# EAGLE design boost-demux_v1 (EAGLE 8.3.1)
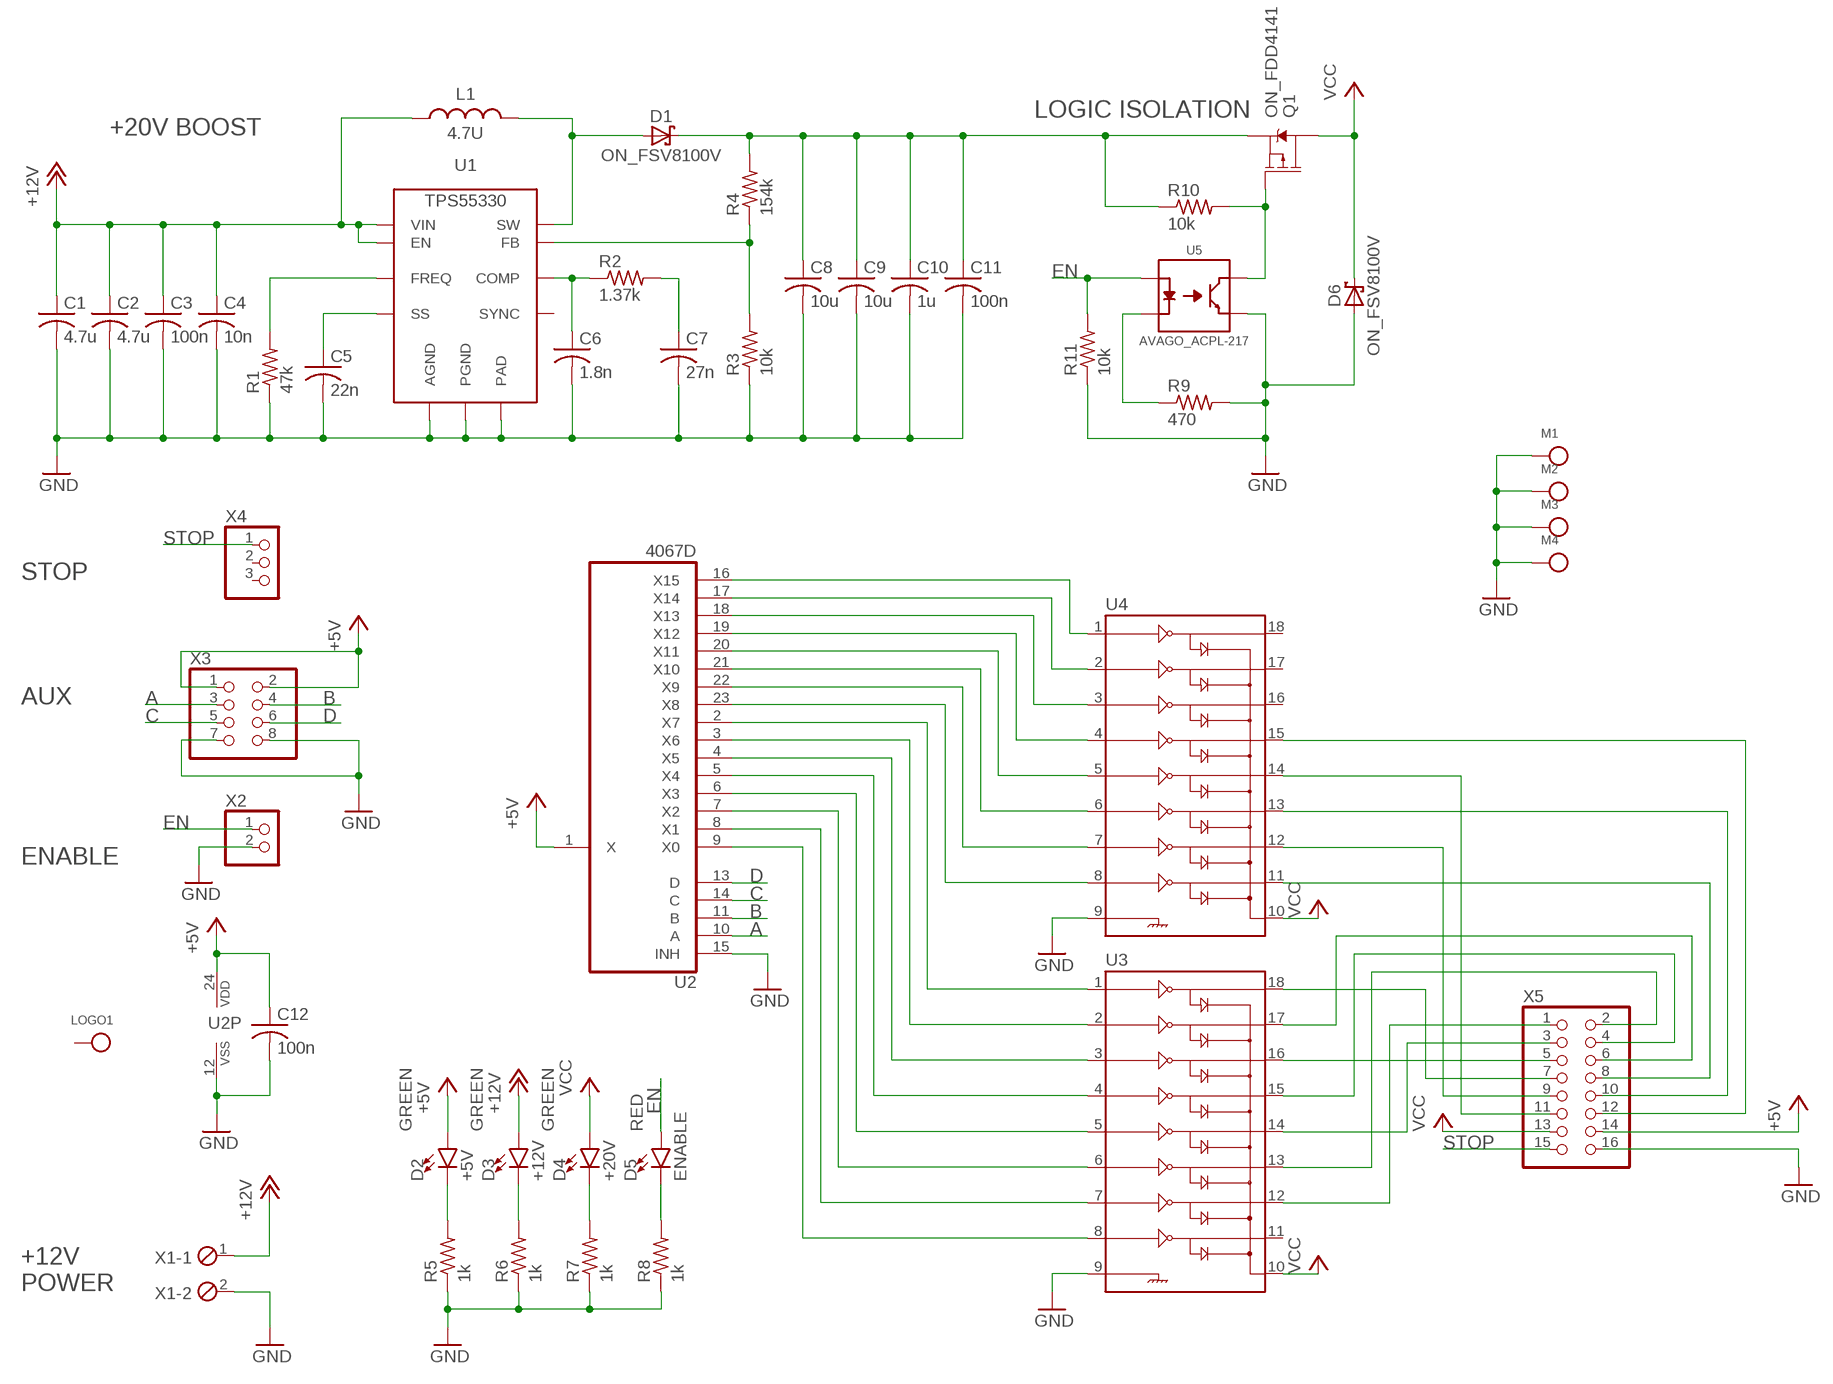
[diagram p0: schematic, sheet 1]

## Parts
C1  4.7u  C-USC1206  [C1206]
C2  4.7u  C-USC1206  [C1206]
C3  100n  C-USC1206  [C1206]
C4  10n  C-USC1206  [C1206]
C5  22n  C-USC1206  [C1206]
C6  1.8n  C-USC0805  [C0805]
C7  27n  C-USC0805  [C0805]
C8  10u  C-USC1206  [C1206]
C9  10u  C-USC1206  [C1206]
C10  1u  C-USC1206  [C1206]
C11  100n  C-USC1206  [C1206]
C12  100n  C-USC1206  [C1206]
D1  ON_FSV8100V  [TO-277-3]
D2  +5V  LED5MM  [LED_5MM]
D3  +12V  LED5MM  [LED_5MM]
D4  +20V  LED5MM  [LED_5MM]
D5  ENABLE  LED5MM  [LED_5MM]
D6  ON_FSV8100V  [TO-277-3]
L1  4.7U  MURATA_FDVE1040  [4440]
LOGO1  MADOG  [MADOG]
M1  6-32_MOUNT  [6-32_MOUNT]
M2  6-32_MOUNT  [6-32_MOUNT]
M3  6-32_MOUNT  [6-32_MOUNT]
M4  6-32_MOUNT  [6-32_MOUNT]
Q1  ON_FDD4141  [TO-252-3]
R1  47k  R-US_R1206  [R1206]
R2  1.37k  R-US_R0805  [R0805]
R3  10k  R-US_R0805  [R0805]
R4  154k  R-US_R0805  [R0805]
R5  1k  R-US_R1206  [R1206]
R6  1k  R-US_R1206  [R1206]
R7  1k  R-US_R1206  [R1206]
R8  1k  R-US_R1206  [R1206]
R9  470  R-US_R1206  [R1206]
R10  10k  R-US_R0805  [R0805]
R11  10k  R-US_R0805  [R0805]
U1  TI_TPS55330  [S-PWQFN-N16]
U2  4067D  [SO24W]
U3  ULN2803SOICW  [SO18L]
U4  ULN2803SOICW  [SO18L]
U5  AVAGO_ACPL-217  [SOIC-4]
X1  MPT2  [2POL254]
X2  PINHD-1X2/90  [1X02/90]
X3  PINHD-2X4/90  [2X04/90]
X4  PINHD-1X3/90  [1X03/90]
X5  PINHD-2X8  [2X08]

## Nets
+5V: C12.1 D2.A U2.1(X) U2.24(VDD) X3.1 X3.2 X5.14
+12V: C1.1 C2.1 C3.1 C4.1 D3.A L1.1 U1.2(VIN) U1.3(EN) X1.1
A: U2.10(A) X3.3
B: U2.11(B) X3.4
C: U2.14(C) X3.5
D: U2.13(D) X3.6
EN: D5.A R11.2 U5.P$1 X2.1
GND: C1.2 C2.2 C3.2 C4.2 C5.2 C6.2 C7.2 C8.2 C9.2 C10.2 C11.2 C12.2 D6.P$1(A) D6.P$2(A) M1.P$1 M1.P$2 M1.P$3 M1.P$4 M1.P$5 M1.P$6 M1.P$7 M1.P$8 M1.P$9 M2.P$1 M2.P$2 M2.P$3 M2.P$4 M2.P$5 M2.P$6 M2.P$7 M2.P$8 M2.P$9 M3.P$1 M3.P$2 M3.P$3 M3.P$4 M3.P$5 M3.P$6 M3.P$7 M3.P$8 M3.P$9 M4.P$1 M4.P$2 M4.P$3 M4.P$4 M4.P$5 M4.P$6 M4.P$7 M4.P$8 M4.P$9 R1.1 R3.1 R5.1 R6.1 R7.1 R8.1 R9.2 R11.1 U1.6(AGND) U1.11(PGND) U1.12(PGND) U1.13(PGND) U1.PAD U2.12(VSS) U2.15(INH) U3.9 U4.9 U5.P$3 X1.2 X2.2 X3.7 X3.8 X5.16
N$1: R1.2 U1.9(FREQ)
N$2: C5.1 U1.4(SS)
N$3: C6.1 R2.1 U1.7(COMP)
N$4: C7.1 R2.2
N$5: R3.2 R4.1 U1.8(FB)
N$6: D2.K(C) R5.2
N$7: D1.P$1(A) D1.P$2(A) L1.2 U1.1(SW) U1.15(SW) U1.16(SW)
N$8: D3.K(C) R6.2
N$9: D4.K(C) R7.2
N$10: D5.K(C) R8.2
N$11: U2.9(X0) U3.8
N$12: C8.1 C9.1 C10.1 C11.1 D1.P$3(C) Q1.P$3(S) R4.2 R10.1
N$13: Q1.P$1(G) R10.2 U5.P$4
N$14: U3.12 X5.1
N$15: U2.8(X1) U3.7
N$16: U2.7(X2) U3.6
N$17: U2.6(X3) U3.5
N$18: U3.13 X5.2
N$19: R9.1 U5.P$2
N$20: U2.5(X4) U3.4
N$21: U2.4(X5) U3.3
N$22: U2.3(X6) U3.2
N$23: U2.2(X7) U3.1
N$24: U2.23(X8) U4.8
N$25: U2.22(X9) U4.7
N$26: U2.21(X10) U4.6
N$27: U2.20(X11) U4.5
N$28: U2.19(X12) U4.4
N$29: U2.18(X13) U4.3
N$30: U2.17(X14) U4.2
N$31: U2.16(X15) U4.1
N$32: U3.14 X5.3
N$33: U3.15 X5.4
N$34: U3.16 X5.5
N$35: U3.17 X5.6
N$36: U3.18 X5.7
N$37: U4.11 X5.8
N$38: U4.12 X5.9
N$39: U4.13 X5.10
N$40: U4.14 X5.11
N$41: U4.15 X5.12
STOP: X4.1 X5.15
VCC: D4.A D6.P$3(C) Q1.P$4(D) U3.10 U4.10 X5.13
Unconnected: LOGO1.P$1 U1.5(SYNC) U3.11 U4.16 U4.17 U4.18 X4.2 X4.3

## Notes on the sheet
- LOGIC ISOLATION
- +20V BOOST
- STOP
- AUX
- ENABLE
- GREEN | GREEN | GREEN | RED
- +12V
  POWER

## Library data of the parts
C1-C12 = rcl:C-US: CAPACITOR, American symbol
D1 D6 = components:ON_FSV8100V
D2-D5 = SparkFun-LED:LED: LED (Generic) Standard schematic elements and footprints for 5mm, 3mm, 1206, and 0603 sized LEDs. Generic LEDs with no color specified.
L1 = components:MURATA_FDVE1040
LOGO1 = components:MADOG
M1-M4 = components:6-32_MOUNT
Q1 = components:ON_FDD4141
R1-R4 R10 R11 = rcl:R-US_: RESISTOR, American symbol
R5-R9 = resistor:R-US_: RESISTOR, American symbol
U1 = components:TI_TPS55330
U2 = 40xx:4067: 16-channel ANALOG MULTIPLEXER
U3 U4 = SparkFun-PowerIC:ULN2803: Darlington Driver ULN2803 Darlington array. 500mA max per channel, 8-channel package. Spark Fun Electronics SKU : COM-00312
U5 = components:AVAGO_ACPL-217
X1 = con-phoenix-254:MPT2: PHOENIX CONNECTOR; OC_FARNELL: unknown; OC_NEWARK: unknown
X2 = pinhead:PINHD-1X2: PIN HEADER
X3 = pinhead:PINHD-2X4: PIN HEADER
X4 = pinhead:PINHD-1X3: PIN HEADER
X5 = pinhead:PINHD-2X8: PIN HEADER

## Board
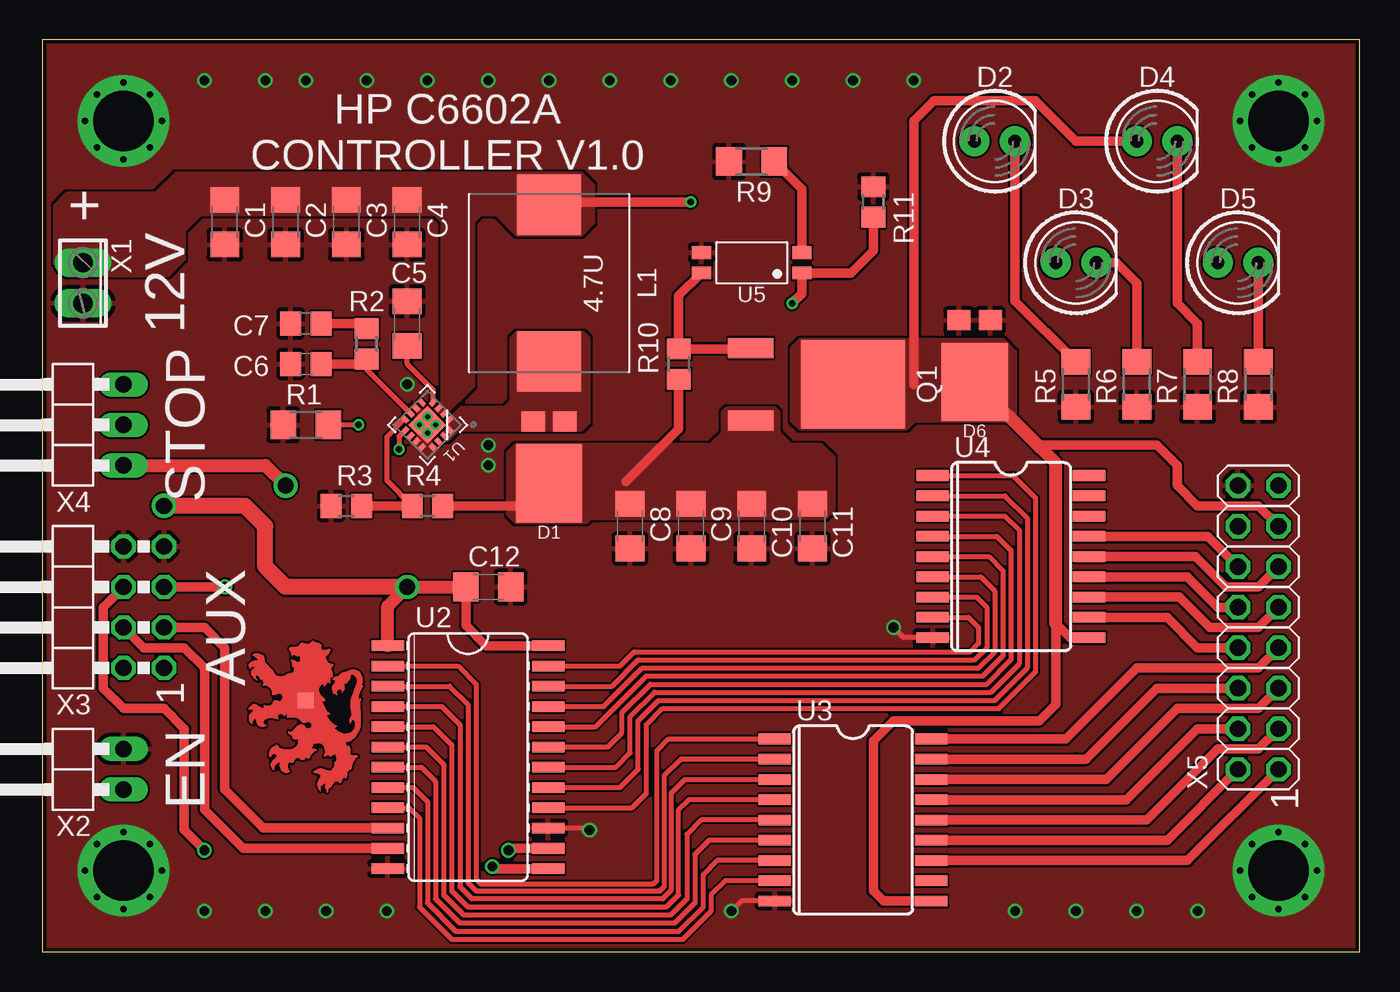
[diagram p1: board, top side]
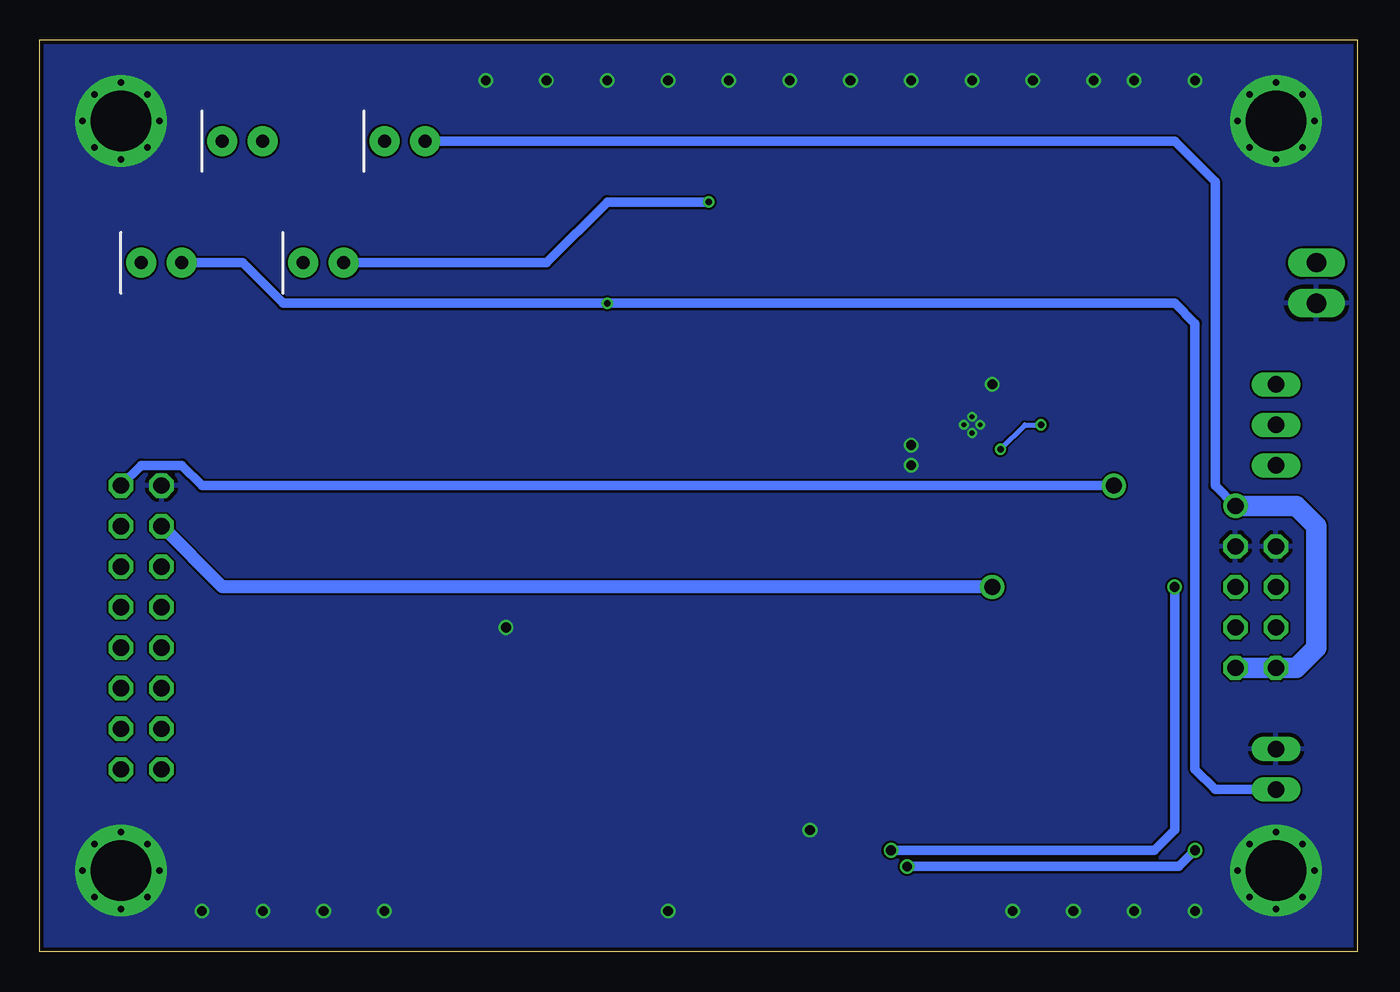
[diagram p2: board, bottom side, seen from below]

Size 82.55 x 57.15 mm. Coordinates in mm from the lower left corner, seen from the top.
Outline: 0,0 82.55,0 82.55,57.15 0,57.15 0,0
Copper layers (1*16): Top 0.035mm / dielectric 1.5mm / Bottom 0.035mm
Design rules "DirtyPCBs-2layer": minimum track width 5mil, minimum drill 12mil, track to track 5mil, track to pad 5mil, pad to pad 5mil, via to via 5mil, smd to smd 0mil, copper to edge 10mil, drill to drill 10mil, minimum pad ring 10mil, minimum via ring 6mil, stop-mask expansion 2mil, vias tented up to drill 25mil, thermal gap 10mil

### Footprints (pad centres in the part's own frame; a part is rotated, then mirrored left to right if it is on the bottom)
C1206 = smd 1.6 x 1.8: 1 -1.4,0; 2 1.4,0
C0805 = smd 1.3 x 1.5: 1 -0.95,0; 2 0.95,0
TO-277-3 = smd 1.45 x 1.25: P$1 0.985,-2.75; P$2 -0.985,-2.75 | smd 4.15 x 4.9: P$3 0,1.125
LED_5MM = drill 0.813 pad 1.88: A -1.27,0; K 1.27,0
4440 = smd 3.8 x 4: 1 -4.9,0; 2 4.9,0
MADOG = smd 1 x 1: P$1 0,1
6-32_MOUNT = drill 3.797 pad 5.715: P$1 0,0 | drill 0.406 pad 0.635: P$2 -2.413,0; P$3 0,2.413; P$4 2.413,0; P$5 0,-2.413; P$6 -1.651,-1.651; P$7 -1.651,1.651; P$8 1.651,1.651; P$9 1.651,-1.651
TO-252-3 = smd 1.25 x 2.85: P$1 -2.28,-6.4; P$3 2.28,-6.4 | smd 5.55 x 6.5: P$4 0,0
R1206 = smd 1.6 x 1.803: 1 -1.422,0; 2 1.422,0
R0805 = smd 1.3 x 1.5: 1 -0.95,0; 2 0.95,0
S-PWQFN-N16 = smd 0.5 x 0.3: 1 -1.25,0.75; 2 -1.25,0.25; 3 -1.25,-0.25; 4 -1.25,-0.75; 9 1.25,-0.75; 10 1.25,-0.25; 11 1.25,0.25; 12 1.25,0.75 | smd 0.3 x 0.5: 5 -0.75,-1.25; 6 -0.25,-1.25; 7 0.25,-1.25; 8 0.75,-1.25; 13 0.75,1.25; 14 0.25,1.25; 15 -0.25,1.25; 16 -0.75,1.25 | smd 1.65 x 1.65: PAD 0,0
SO24W = smd 0.66 x 2.032: 1 -6.985,-5.029; 2 -5.715,-5.029; 3 -4.445,-5.029; 4 -3.175,-5.029; 5 -1.905,-5.029; 6 -0.635,-5.029; 7 0.635,-5.029; 8 1.905,-5.029; 9 3.175,-5.029; 10 4.445,-5.029; 11 5.715,-5.029; 12 6.985,-5.029; 13 6.985,5.029; 14 5.715,5.029; 15 4.445,5.029; 16 3.175,5.029; 17 1.905,5.029; 18 0.635,5.029; 19 -0.635,5.029; 20 -1.905,5.029; 21 -3.175,5.029; 22 -4.445,5.029; 23 -5.715,5.029; 24 -6.985,5.029
SO18L = smd 0.66 x 2.032: 1 -0.635,-4.902; 2 0.635,-4.902; 3 1.905,-4.902; 4 3.175,-4.902; 5 4.445,-4.902; 6 5.715,-4.902; 7 6.985,-4.902; 8 8.255,-4.902; 9 9.525,-4.902; 10 9.525,4.902; 11 8.255,4.902; 12 6.985,4.902; 13 5.715,4.902; 14 4.445,4.902; 15 3.175,4.902; 16 1.905,4.902; 17 0.635,4.902; 18 -0.635,4.902
SOIC-4 = smd 1.2 x 0.8: P$1 -3.15,0.635; P$2 -3.15,-0.635; P$3 3.15,-0.635; P$4 3.15,0.635
2POL254 = drill 1.2 long: 1 -1.27,0; 2 1.27,0
1X02/90 = drill 1.016 long: 1 -1.27,-3.81; 2 1.27,-3.81
2X04/90 = drill 1.016 octagon: 1 -3.81,-6.35; 2 -3.81,-3.81; 3 -1.27,-6.35; 4 -1.27,-3.81; 5 1.27,-6.35; 6 1.27,-3.81; 7 3.81,-6.35; 8 3.81,-3.81
1X03/90 = drill 1.016 long: 1 -2.54,-3.81; 2 0,-3.81; 3 2.54,-3.81
2X08 = drill 1.016 octagon: 1 -8.89,-1.27; 2 -8.89,1.27; 3 -6.35,-1.27; 4 -6.35,1.27; 5 -3.81,-1.27; 6 -3.81,1.27; 7 -1.27,-1.27; 8 -1.27,1.27; 9 1.27,-1.27; 10 1.27,1.27; 11 3.81,-1.27; 12 3.81,1.27; 13 6.35,-1.27; 14 6.35,1.27; 15 8.89,-1.27; 16 8.89,1.27

### Placement (x,y rotation side)
C1  11.43,45.72 270 top
C2  15.24,45.72 270 top
C3  19.05,45.72 270 top
C4  22.86,45.72 270 top
C5  22.86,39.37 90 top
C6  16.51,36.83 180 top
C7  16.51,39.37 180 top
C8  36.83,26.67 270 top
C9  40.64,26.67 270 top
C10  44.45,26.67 270 top
C11  48.26,26.67 270 top
C12  27.94,22.86 0 top
D1  31.75,30.48 180 top
D2  59.69,50.8 0 top
D3  64.77,43.18 0 top
D4  69.85,50.8 0 top
D5  74.93,43.18 0 top
D6  58.42,36.83 180 top
L1  31.75,41.91 270 top
LOGO1  16.51,14.73 0 top
M1  5.08,52.07 0 top
M2  5.08,5.08 0 top
M3  77.47,52.07 0 top
M4  77.47,5.08 0 top
Q1  50.8,35.56 270 top
R1  16.51,33.02 0 top
R2  20.32,38.1 90 top
R3  19.05,27.94 0 top
R4  24.13,27.94 0 top
R5  64.77,35.56 90 top
R6  68.58,35.56 90 top
R7  72.39,35.56 90 top
R8  76.2,35.56 90 top
R9  44.45,49.53 180 top
R10  39.88,36.83 90 top
R11  52.07,46.99 270 top
U1  24.13,33.02 225 top
U2  26.67,12.19 270 top
U3  50.8,12.7 270 top
U4  60.71,29.21 270 top
U5  44.45,43.18 180 top
X1  2.54,41.91 270 top
X2  1.27,11.43 90 top
X3  1.27,21.59 90 top
X4  1.27,33.02 90 top
X5  76.2,20.32 90 top

### Tracks (layer width: path | path; a pad name or v marks a point on that pad's centre or on a via)
+5V  (via drill 1.02)
  Top 0.61: U2.24 27.81,19.18 26.54,20.45 C12.1
  Top 0.813: U2.1 21.64,21.64 v22.86,22.86 C12.1
  Top 1.016: v22.86,22.86 15.24,22.86 13.97,24.13 13.97,26.67 12.7,27.94 v7.62,27.94
  Bottom 0.61: D2.A 11.43,50.8 8.89,48.26 8.89,29.21 v7.62,27.94
  Bottom 0.813: v22.86,22.86 71.12,22.86 X5.14
  Bottom 1.27: v7.62,27.94 3.81,27.94 2.54,26.67 2.54,19.05 3.81,17.78 X3.2 X3.1
+12V  (via drill 0.41)
  Top 0.61: v40.64,46.99 31.93,46.99 L1.1
  Bottom 0.61: D3.A 50.8,43.18 46.99,46.99 v40.64,46.99
  pour Top (no thermals): 1.52,42.42 7.87,42.42 8.89,43.43 8.89,45.21 9.91,46.23 28.45,46.23 29.72,44.96 33.78,44.96 34.54,45.72 34.54,48.01 33.78,48.77 8.38,48.77 7.11,47.5 1.52,47.5 0.76,46.74 0.76,43.18
  pour Top (no thermals): 24.61,34.01 25.02,34.42 25.02,45.72 24.51,46.23 27.56,46.23 27.05,45.72 27.05,35.43 25.12,33.5
A
  Top 0.61: U2.10 13.84,7.75 11.43,10.16 11.43,19.05 10.16,20.32 X3.3
B
  Top 0.61: U2.11 12.57,6.48 10.16,8.89 10.16,17.78 8.89,19.05 6.35,19.05 X3.4
C  (via drill 0.61)
  Top 0.61: U2.14 29.34,6.48 v29.21,6.35 | v11.43,22.86 X3.5
  Bottom 0.61: v29.21,6.35 12.7,6.35 11.43,7.62 v11.43,22.86
D  (via drill 0.61)
  Top 0.61: U2.13 28.32,5.21 v28.19,5.33 | v10.16,6.35 8.89,7.62 8.89,13.97 7.62,15.24 5.08,15.24 3.81,16.51 3.81,21.59 X3.6
  Bottom 0.61: v28.19,5.33 11.18,5.33 v10.16,6.35
EN  (via drill 0.41)
  Top 0.61: R11.2 52.07,43.94 50.67,42.55 U5.P$1 47.6,41.25 v46.99,40.64
  Bottom 0.61: X2.1 8.89,10.16 10.16,11.43 10.16,39.37 11.43,40.64 v46.99,40.64 67.31,40.64 69.85,43.18 D5.A
GND  (via drill 0.3, 0.61)
  Top 0.305: U4.9 53.98,19.68 v53.34,20.32 | U3.9 43.81,3.17 v43.18,2.54 | U2.15 34.16,7.75 v34.29,7.62
  other vias: 10.16,54.61 13.97,54.61 20.32,54.61 16.51,54.61 24.13,54.61 27.94,54.61 31.75,54.61 35.56,54.61 39.37,54.61 43.18,54.61 46.99,54.61 50.8,54.61 54.61,54.61 10.16,2.54 13.97,2.54 17.78,2.54 60.96,2.54 64.77,2.54 68.58,2.54 72.39,2.54 27.94,30.48 27.94,31.75 22.86,35.56 24.13,33.53 24.64,33.02 24.13,32.51 23.62,33.02 21.59,2.54
  pour Bottom: 0,57.15 82.55,57.15 82.55,0 0,0
  pour Top (rank 2): 0,57.15 82.55,57.15 82.55,0 0,0
  pour Top (no thermals): 23.37,34.29 24.26,33.4 24.26,32 24.89,31.37 24.89,31.24 24.13,30.48 23.11,31.5 23.11,31.75 23.5,32.13 23.5,33.91 23.24,34.16
N$1  (via drill 0.41)
  Top 0.305: U1.9 22.35,32.3 v22.35,31.5 | v19.81,33.02 R1.2
  Bottom 0.305: v22.35,31.5 20.83,33.02 v19.81,33.02
N$2
  Top 0.305: U1.4 24.48,35.21 22.86,36.83 C5.1
N$3
  Top 0.305: U1.7 20.32,36.48 R2.1
  Top 0.61: C6.1 20,36.83 R2.1
N$4
  Top 0.61: C7.1 20,39.37 R2.2
N$5
  Top 0.305: R4.1 21.59,29.53 21.59,32.26 22.71,33.37 U1.8
  Top 0.61: R3.2 R4.1
N$6
  Top 0.61: D2.K 60.96,40.79 R5.2
N$7
  pour Top (no thermals): 29.72,38.86 33.91,38.86 34.29,38.48 34.29,33.15 33.78,32.64 26.04,32.64 25.4,31.98 24.99,32.38 25.5,32.89 25.5,33.12 25.32,33.3 26.24,34.16 28.96,34.16 29.34,34.54 29.34,38.48
N$8
  Top 0.61: D3.K 67.31,43.18 68.58,41.91 R6.2
N$9
  Top 0.61: D4.K 71.12,40.64 72.39,39.37 R7.2
N$10
  Top 0.61: D5.K R8.2
N$11
  Top 0.305: U2.9 22.99,9.02 23.62,8.38 23.62,2.79 25.65,0.76 40.13,0.76 41.91,2.54 41.91,3.56 42.8,4.45 U3.8
N$12
  Top 0.61: R4.2 30.34,27.94 D1.P$3 | R10.1 39.88,32.77 36.58,29.46
  pour Top (no thermals): 29.72,31.75 41.91,31.75 42.67,32.51 42.67,33.78 42.93,34.04 45.85,34.04 46.1,33.78 46.1,32.51 46.86,31.75 48.77,31.75 49.53,30.99 49.53,27.69 49.02,27.18 34.29,27.18 34.04,26.92 29.72,26.92 29.21,27.43 29.21,31.24
N$13
  Top 0.61: Q1.P$1 44.34,37.78 R10.2 39.88,41.12 U5.P$4
N$14
  Top 0.61: U3.12 71.75,5.71 X5.1
N$15
  Top 0.305: U2.8 23.24,10.29 24.13,9.4 24.13,3.05 25.91,1.27 39.88,1.27 41.4,2.79 41.4,4.83 42.29,5.71 U3.7
N$16
  Top 0.305: U2.7 23.75,11.56 24.64,10.67 24.64,3.3 26.16,1.78 39.62,1.78 40.89,3.05 40.89,6.1 41.78,6.99 U3.6
N$17
  Top 0.305: U2.6 24.05,12.83 25.15,11.73 25.15,3.56 26.42,2.29 39.37,2.29 40.39,3.3 40.39,7.37 41.27,8.26 U3.5
N$18
  Top 0.61: U3.13 70.48,6.99 X5.2
N$19
  Top 0.61: U5.P$2 47.6,47.8 R9.1
N$20
  Top 0.305: U2.5 24.51,14.1 25.65,12.95 25.65,3.81 26.67,2.79 39.06,2.79 39.88,3.56 39.88,8.89 40.51,9.53 U3.4
N$21
  Top 0.305: U3.3 40.26,10.79 39.42,9.96 39.42,3.86 38.86,3.3 26.92,3.3 26.16,4.06 26.16,14.22 25.02,15.37 U2.4
N$22
  Top 0.305: U2.3 25.53,16.64 26.67,15.49 26.67,4.32 27.18,3.81 38.71,3.81 38.96,4.06 38.96,11.02 40.01,12.06 U3.2
N$23
  Top 0.305: U3.1 39.24,13.34 38.51,12.6 38.51,4.47 38.3,4.27 27.43,4.27 27.18,4.52 27.18,16.76 26.04,17.91 U2.2
N$24
  Top 0.305: U2.23 36.2,17.91 37.08,18.8 58.17,18.8 58.67,19.3 58.67,20.32 58.04,20.95 U4.8
N$25
  Top 0.305: U2.22 35.69,16.64 37.34,18.29 58.42,18.29 59.18,19.05 59.18,21.59 58.55,22.23 U4.7
N$26
  Top 0.305: U2.21 35.18,15.37 37.59,17.78 58.67,17.78 59.69,18.8 59.69,22.61 58.8,23.5 U4.6
N$27
  Top 0.305: U2.20 34.67,14.1 37.85,17.27 58.93,17.27 60.2,18.54 60.2,23.88 59.31,24.77 U4.5
N$28
  Top 0.305: U2.19 35.43,12.83 36.32,13.72 36.32,14.99 38.1,16.76 59.18,16.76 60.71,18.29 60.71,25.15 59.82,26.04 U4.4
N$29
  Top 0.305: U2.18 35.94,11.56 36.83,12.45 36.83,14.73 38.35,16.26 59.44,16.26 61.21,18.03 61.21,26.42 60.33,27.3 U4.3
N$30
  Top 0.305: U2.17 36.2,10.29 37.34,11.43 37.34,14.48 38.61,15.75 59.69,15.75 61.72,17.78 61.72,27.18 60.33,28.57 U4.2
N$31
  Top 0.305: U2.16 36.96,9.02 37.85,9.91 37.85,14.22 38.86,15.24 59.94,15.24 62.23,17.53 62.23,28.45 60.83,29.84 U4.1
N$32
  Top 0.61: U3.14 69.22,8.26 73.66,12.7 76.2,12.7 X5.3
N$33
  Top 0.61: U3.15 67.94,9.53 72.39,13.97 X5.4
N$34
  Top 0.61: U3.16 66.67,10.79 71.12,15.24 76.2,15.24 X5.5
N$35
  Top 0.61: U3.17 64.77,12.06 65.41,12.06 69.85,16.51 X5.6
N$36
  Top 0.61: U3.18 64.14,13.34 68.58,17.78 76.2,17.78 X5.7
N$37
  Top 0.61: U4.11 70.48,20.95 72.39,19.05 X5.8
N$38
  Top 0.61: U4.12 71.25,22.23 73.15,20.32 76.2,20.32 X5.9
N$39
  Top 0.61: U4.13 71.75,23.5 73.66,21.59 X5.10
N$40
  Top 0.61: U4.14 72.26,24.77 74.17,22.86 76.2,22.86 X5.11
N$41
  Top 0.61: U4.15 73.03,26.04 X5.12
STOP  (via drill 1.02)
  Top 0.813: X4.1 13.97,30.48 v15.24,29.21
  Bottom 0.61: X5.15 76.2,30.48 73.66,30.48 72.39,29.21 v15.24,29.21
VCC
  Top 0.61: D4.A 64.77,50.8 62.23,53.34 55.88,53.34 54.61,52.07 54.61,35.56 | U4.10 64.39,19.68 63.5,20.57 63.5,15.49 62.48,14.48 53.34,14.48 52.07,13.21 52.07,3.81 52.7,3.17 U3.10 | X5.13 76.2,27.94 72.39,27.94 71.12,29.21 71.12,30.48 69.85,31.75 62.63,31.75 62.5,31.62
  Top 0.813: 63.5,20.57 63.5,30.62 62.5,31.62 D6.P$3
  pour Top (no thermals): 47.5,38.35 60.2,38.35 60.96,37.59 60.96,33.78 60.45,33.27 54.61,33.27 54.1,32.77 47.5,32.77 46.99,33.27 46.99,37.85

### Text on the board
tPlace: HP C6602A / CONTROLLER V1.0 | + | 12V | STOP | AUX | 1 | EN | 1